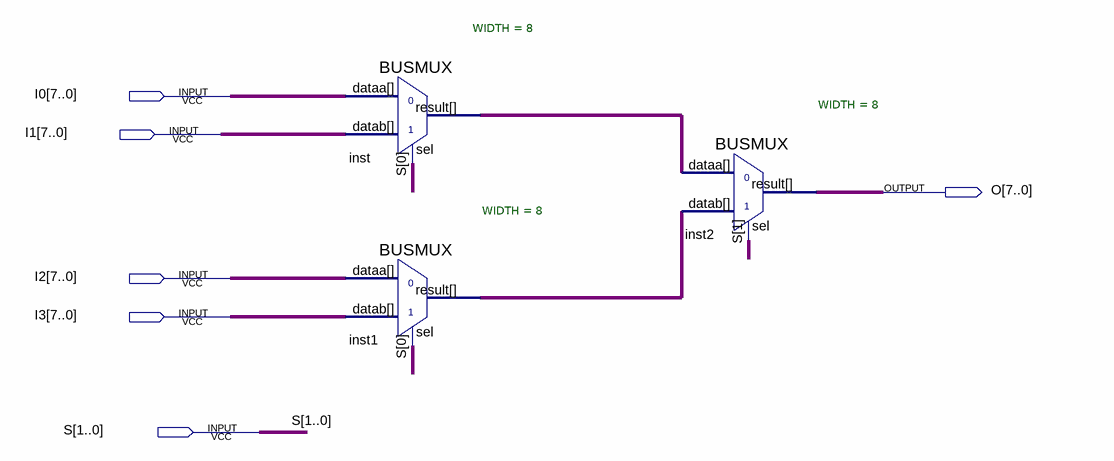
[diagram p0: schematic sheet]
// Quartus schematic MUX4TO1.bdf as structural Verilog: 3 symbols, 6 pins
module MUX4TO1 (
  input  [7:0] I0,
  input  [7:0] I1,
  input  [7:0] I2,
  input  [7:0] I3,
  input  [1:0] S,
  output [7:0] O
);

  wire [7:0] inst1_result, inst_result;

  BUSMUX #(.WIDTH(8)) inst (.datab(I1), .sel(S[0]), .dataa(I0), .result(inst_result));
  BUSMUX #(.WIDTH(8)) inst1 (.datab(I3), .sel(S[0]), .dataa(I2), .result(inst1_result));
  BUSMUX #(.WIDTH(8)) inst2 (.datab(inst1_result), .sel(S[1]), .dataa(inst_result), .result(O));
endmodule
